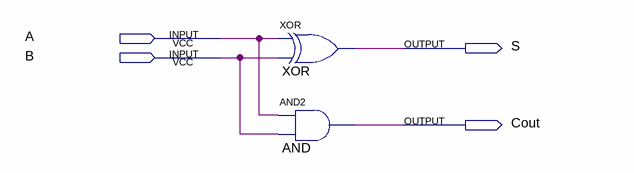
[diagram p0: schematic sheet]
// Quartus schematic HA.bdf as structural Verilog: 2 symbols, 4 pins
module HA (
  input  A,
  input  B,
  output S,
  output Cout
);

  xor XOR (S, A, B);
  and AND (Cout, A, B);
endmodule
